# Altium schematic sheet 电机驱动.SchDoc
size A4
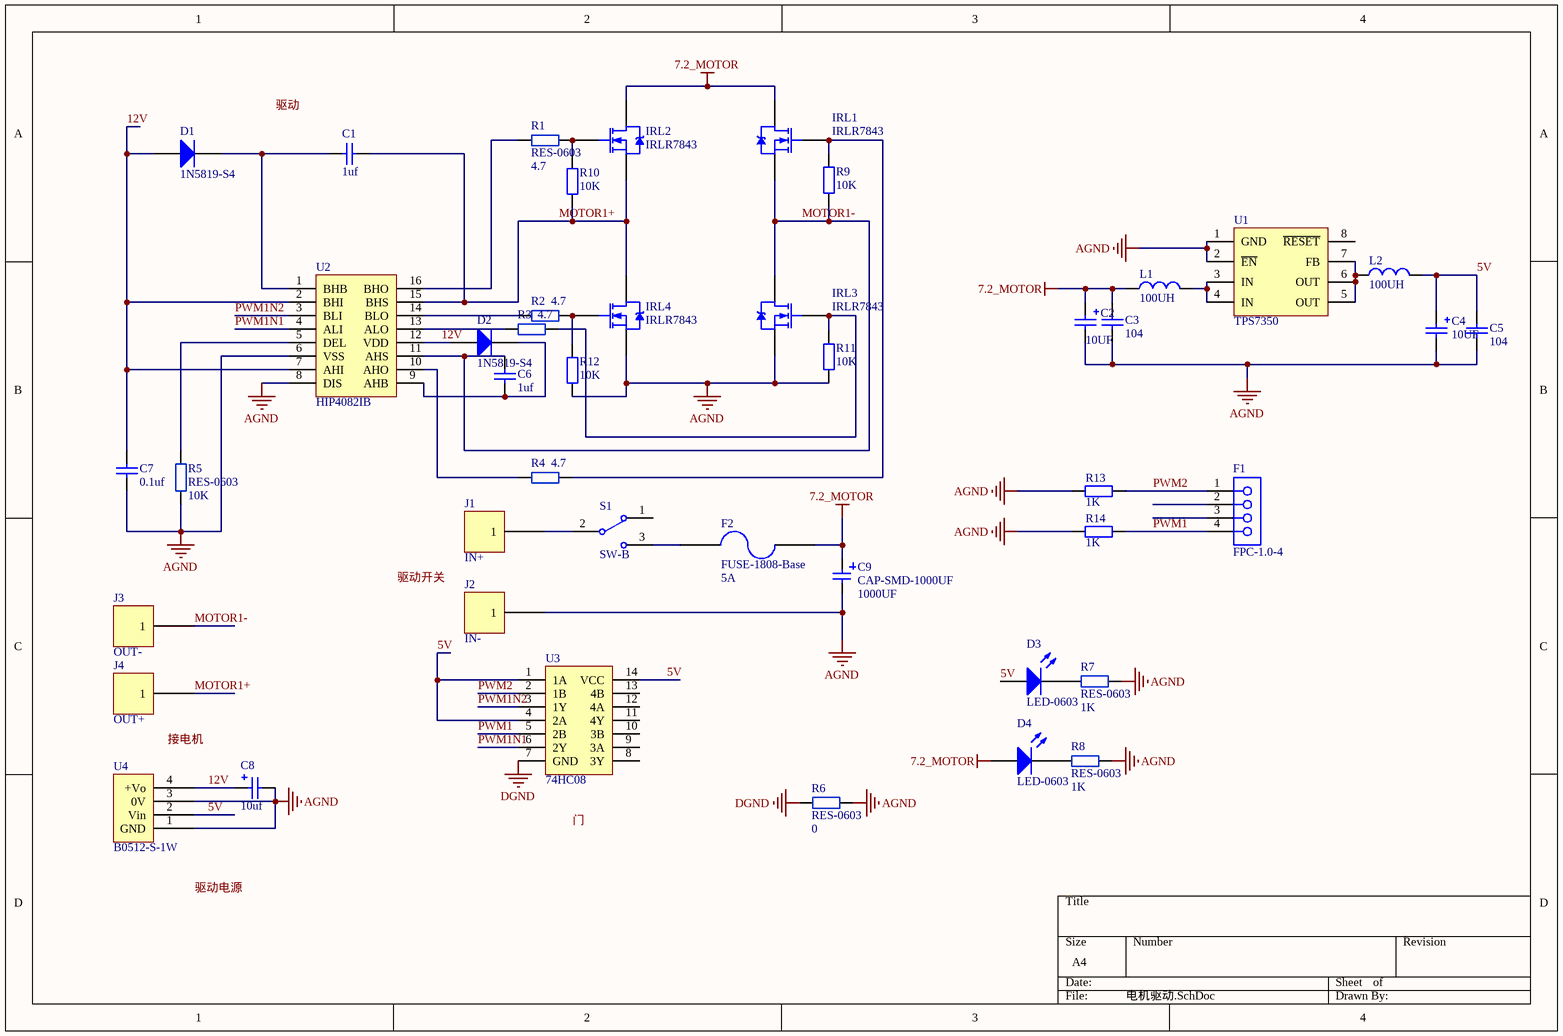
[diagram p0: 电机驱动.SchDoc]

## Parts
C1  CAP-0603(1608)  [CAP-0603]  (value not drawn)
C2  CAP-TAN-3528(B)  [CAP-3528]  (value not drawn)
C3  CAP-0603(1608)  [CAP-0603]  (value not drawn)
C4  CAP-TAN-3528(B)  [CAP-3528]  (value not drawn)
C5  CAP-0603(1608)  [CAP-0603]  (value not drawn)
C6  CAP-0603(1608)  [CAP-0603]  (value not drawn)
C7  CAP-0603(1608)  [CAP-0603]  (value not drawn)
C8  CAP-TAN-3528(B)  [CAP-3528]  (value not drawn)
C9  CAP-SMD-1000UF  [CAP-SMD-1000UF]
D1  1N5819-S4  [SOD-323]
D2  1N5819-S4  [SOD-323]
D3  LED-0603  [LED-0603]
D4  LED-0603  [LED-0603]
F1  FPC-1.0-4  [FPC-1.0-4]
F2  FUSE-1808-Base  [Fuse1808_Base]
IRL1  IRLR7843  [TO-252]
IRL2  IRLR7843  [TO-252]
IRL3  IRLR7843  [TO-252]
IRL4  IRLR7843  [TO-252]
J1  IN+  [HEADER1X1]
J2  IN-  [HEADER1X1]
J3  OUT-  [HEADER1X1]
J4  OUT+  [HEADER1X1]
L1  INTUCTOR  [L0805 - duplicate]  (value not drawn)
L2  INTUCTOR  [L0805 - duplicate]  (value not drawn)
R1  RES-0603  [RES-0603]
R2  RES-0603  [RES-0603]  (value not drawn)
R3  RES-0603  [RES-0603]  (value not drawn)
R4  RES-0603  [RES-0603]  (value not drawn)
R5  RES-0603  [RES-0603]
R6  RES-0603  [RES-0603]
R7  RES-0603  [RES-0603]
R8  RES-0603  [RES-0603]
R9  RES  [0603RC]  (value not drawn)
R10  RES  [0603RC]  (value not drawn)
R11  RES  [0603RC]  (value not drawn)
R12  RES  [0603RC]  (value not drawn)
R13  1K  [0603RC]
R14  1K  [0603RC]
S1  SW-B  [SW-B]
U1  TPS7350  [TPS7350(7333)]
U2  HIP4082IB  [SOIC16]
U3  74HC08  [SOIC14]
U4  B0512-S-1W  [B0512_S_1W]

## Nets
7.2_MOTOR: C2.1 C3.2 C9.1 D4.1(A) F2.2 IRL1.2(D) IRL2.2(D) L1.1
AGND: C2.2 C3.1 C4.2 C5.1 C7.1 C8.2 C9.2 IRL3.3(S) IRL4.3(S) J2.1 R5.1 R6.2 R7.2 R8.2 R11.1 R12.1 R13.1 R14.1 U1.1(GND) U1.2(~{EN}) U2.6(VSS) U2.8(DIS) U4.1(GND) U4.3(0V)
DGND: R6.1 U3.7(GND)
5V: C4.1 C5.2 D3.1(A) L2.2 U3.1(1A) U3.4(2A) U3.14(VCC) U4.2(Vin)
12V: C7.2 C8.1 D1.1(A) D2.1(A) U2.2(BHI) U2.7(AHI) U2.12(VDD) U4.4(+Vo)
MOTOR1+: C1.2 IRL2.3(S) IRL4.2(D) J4.1 R10.1 U2.15(BHS)
MOTOR1-: C6.2 IRL1.3(S) IRL3.2(D) J3.1 R9.1 U2.11(AHS)
PWM1: F1.4 R14.2 U3.5(2B)
PWM1N1: U2.4(ALI) U3.6(2Y)
PWM1N2: U2.3(BLI) U3.3(1Y)
PWM2: F1.1 R13.2 U3.2(1B)
NetC1_1: C1.1 D1.2(K) U2.1(BHB)
NetC6_1: C6.1 D2.2(K) U2.9(AHB)
NetD3_2: D3.2(K) R7.1
NetD4_2: D4.2(K) R8.1
NetF2_1: F2.1 S1.3
NetIRL1_1: IRL1.1(G) R4.2 R9.2
NetIRL2_1: IRL2.1(G) R1.2 R10.2
NetIRL3_1: IRL3.1(G) R3.2 R11.2
NetIRL4_1: IRL4.1(G) R2.2 R12.2
NetJ1_1: J1.1 S1.2
NetL1_2: L1.2 U1.3(IN) U1.4(IN)
NetL2_1: L2.1 U1.5(OUT) U1.6(OUT) U1.7(FB)
NetR1_1: R1.1 U2.16(BHO)
NetR2_1: R2.1 U2.14(BLO)
NetR3_1: R3.1 U2.13(ALO)
NetR4_1: R4.1 U2.10(AHO)
NetR5_2: R5.2 U2.5(DEL)

Not connected (* = marked no-connect by the designer): F1 2 3; S1 1; U1 8(~{RESET}); U3 8(3Y) 9(3A) 10(3B) 11(4Y) 12(4A) 13(4B)

## Notes on the sheet
- Labels drawn without touching a wire or pin: 接电机, 门, 驱动, 驱动开关, 驱动电源
- (in symbol CAP-0603(1608)) 1uf; 0.1uf; 104
- (in symbol CAP-SMD-1000UF) 1000UF
- (in symbol CAP-TAN-3528(B)) 10UF; 10uf
- (in symbol FUSE-1808-Base) 5A
- (in symbol INTUCTOR) 100UH
- (in symbol RES) 10K
- (in symbol RES-0603) 1K
- (in symbol RES-0805) 10K; 4.7; 0

## Library data of the parts
C2 C4 C8 = CAP-TAN-3528(B): 0.15~150UF
D1 D2 = 1N5819-S4: S4
F2 = FUSE-1808-Base: 保险丝
J1-J4 = Header1x1
R1-R6 = RES-0805
R13 R14 = Res2: Resistor; Published: 8-Jun-2000; LatestRevisionDate: 17-Jul-2002; LatestRevisionNote: Re-released for DXP Platform.; PackageReference: AXIAL-0.4; Publisher: Altium Limited; Value: 1K